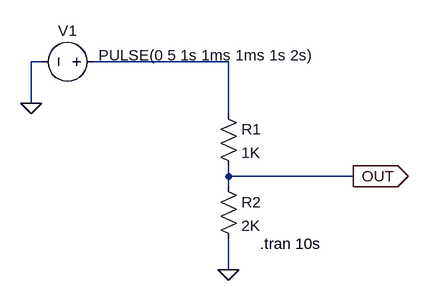
[diagram p0: schematic Voltage_Divider_Level_Shifter_5V_to_3V3.asc]
Voltage_Divider_Level_Shifter_5V_to_3V3.asc, the LTspice schematic file:
Version 4
SHEET 1 880 680
WIRE -144 48 -160 48
WIRE 144 48 -64 48
WIRE -160 112 -160 48
WIRE 144 128 144 48
WIRE 144 224 144 208
WIRE 336 224 144 224
WIRE 144 240 144 224
WIRE 144 368 144 320
FLAG 336 224 OUT
IOPIN 336 224 Out
FLAG 144 368 0
FLAG -160 112 0
SYMBOL res 128 112 R0
SYMATTR InstName R1
SYMATTR Value 1K
SYMBOL res 128 224 R0
SYMATTR InstName R2
SYMATTR Value 2K
SYMBOL voltage -48 48 R90
WINDOW 0 -32 56 VBottom 2
WINDOW 3 -26 -157 VTop 2
WINDOW 123 0 0 Left 0
WINDOW 39 0 0 Left 0
SYMATTR InstName V1
SYMATTR Value PULSE(0 5 1s 1ms 1ms 1s 2s)
TEXT 192 328 Left 2 !.tran 10s

The netlist it stands for:
* Voltage_Divider_Level_Shifter_5V_to_3V3.asc
R1 N001 OUT 1K
R2 OUT 0 2K
V1 N001 0 PULSE(0 5 1s 1ms 1ms 1s 2s)
.tran 10s
.backanno
.end